# Altium project fpc_force_sensor.PrjPcb
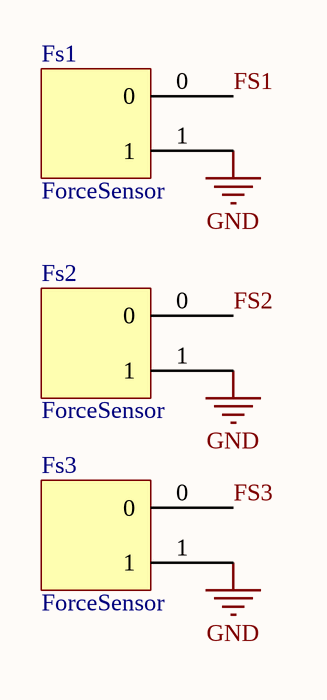
[diagram p0: fpc_1.SchDoc]
1 sheet, 3 parts. Net scope: global (net labels, ports and power ports of the same name join across sheets).
Board file: PCB1.PcbDoc

## Sheet fpc_1.SchDoc
size A; SheetNumber: 1; SheetTotal: 1

### Parts
Fs1  ForceSensor  [sensor_connector]
Fs2  ForceSensor  [sensor_connector]
Fs3  ForceSensor  [sensor_connector]

### Nets
GND: Fs1.1 Fs2.1 Fs3.1
FS1: Fs1.0
FS2: Fs2.0
FS3: Fs3.0